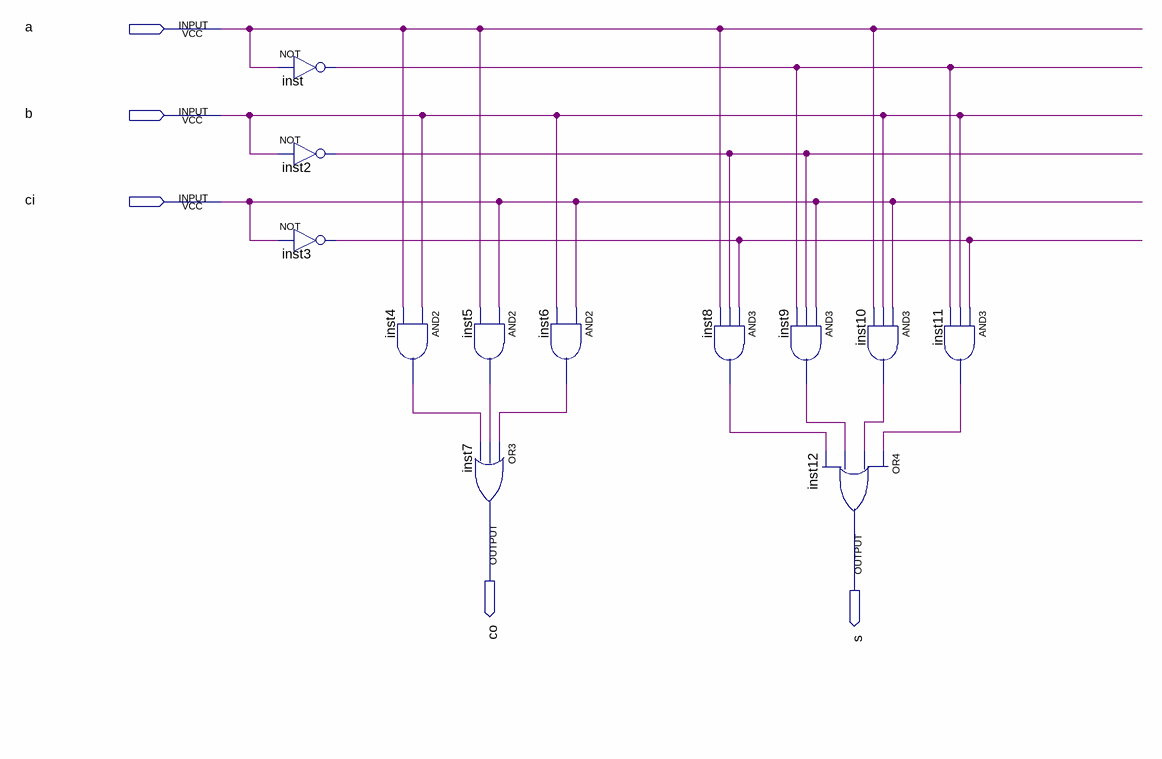
[diagram p0: schematic sheet]
// Quartus schematic full_adder.bdf as structural Verilog: 12 symbols, 5 pins
module full_adder (
  input  a,
  input  b,
  input  ci,
  output co,
  output s
);

  wire inst2_out, inst3_out, inst4_out, inst5_out, inst6_out, inst8_out, inst9_out, inst10_out, inst11_out,
       inst_out;

  not inst (inst_out, a);
  not inst2 (inst2_out, b);
  not inst3 (inst3_out, ci);
  and inst4 (inst4_out, b, a);
  and inst5 (inst5_out, ci, a);
  or inst7 (co, inst6_out, inst5_out, inst4_out);
  and inst6 (inst6_out, ci, b);
  and inst8 (inst8_out, inst3_out, inst2_out, a);
  and inst9 (inst9_out, ci, inst2_out, inst_out);
  and inst10 (inst10_out, ci, b, a);
  or inst12 (s, inst11_out, inst10_out, inst9_out, inst8_out);
  and inst11 (inst11_out, inst3_out, b, inst_out);
endmodule
